# EAGLE design crown-B (EAGLE 6.4)
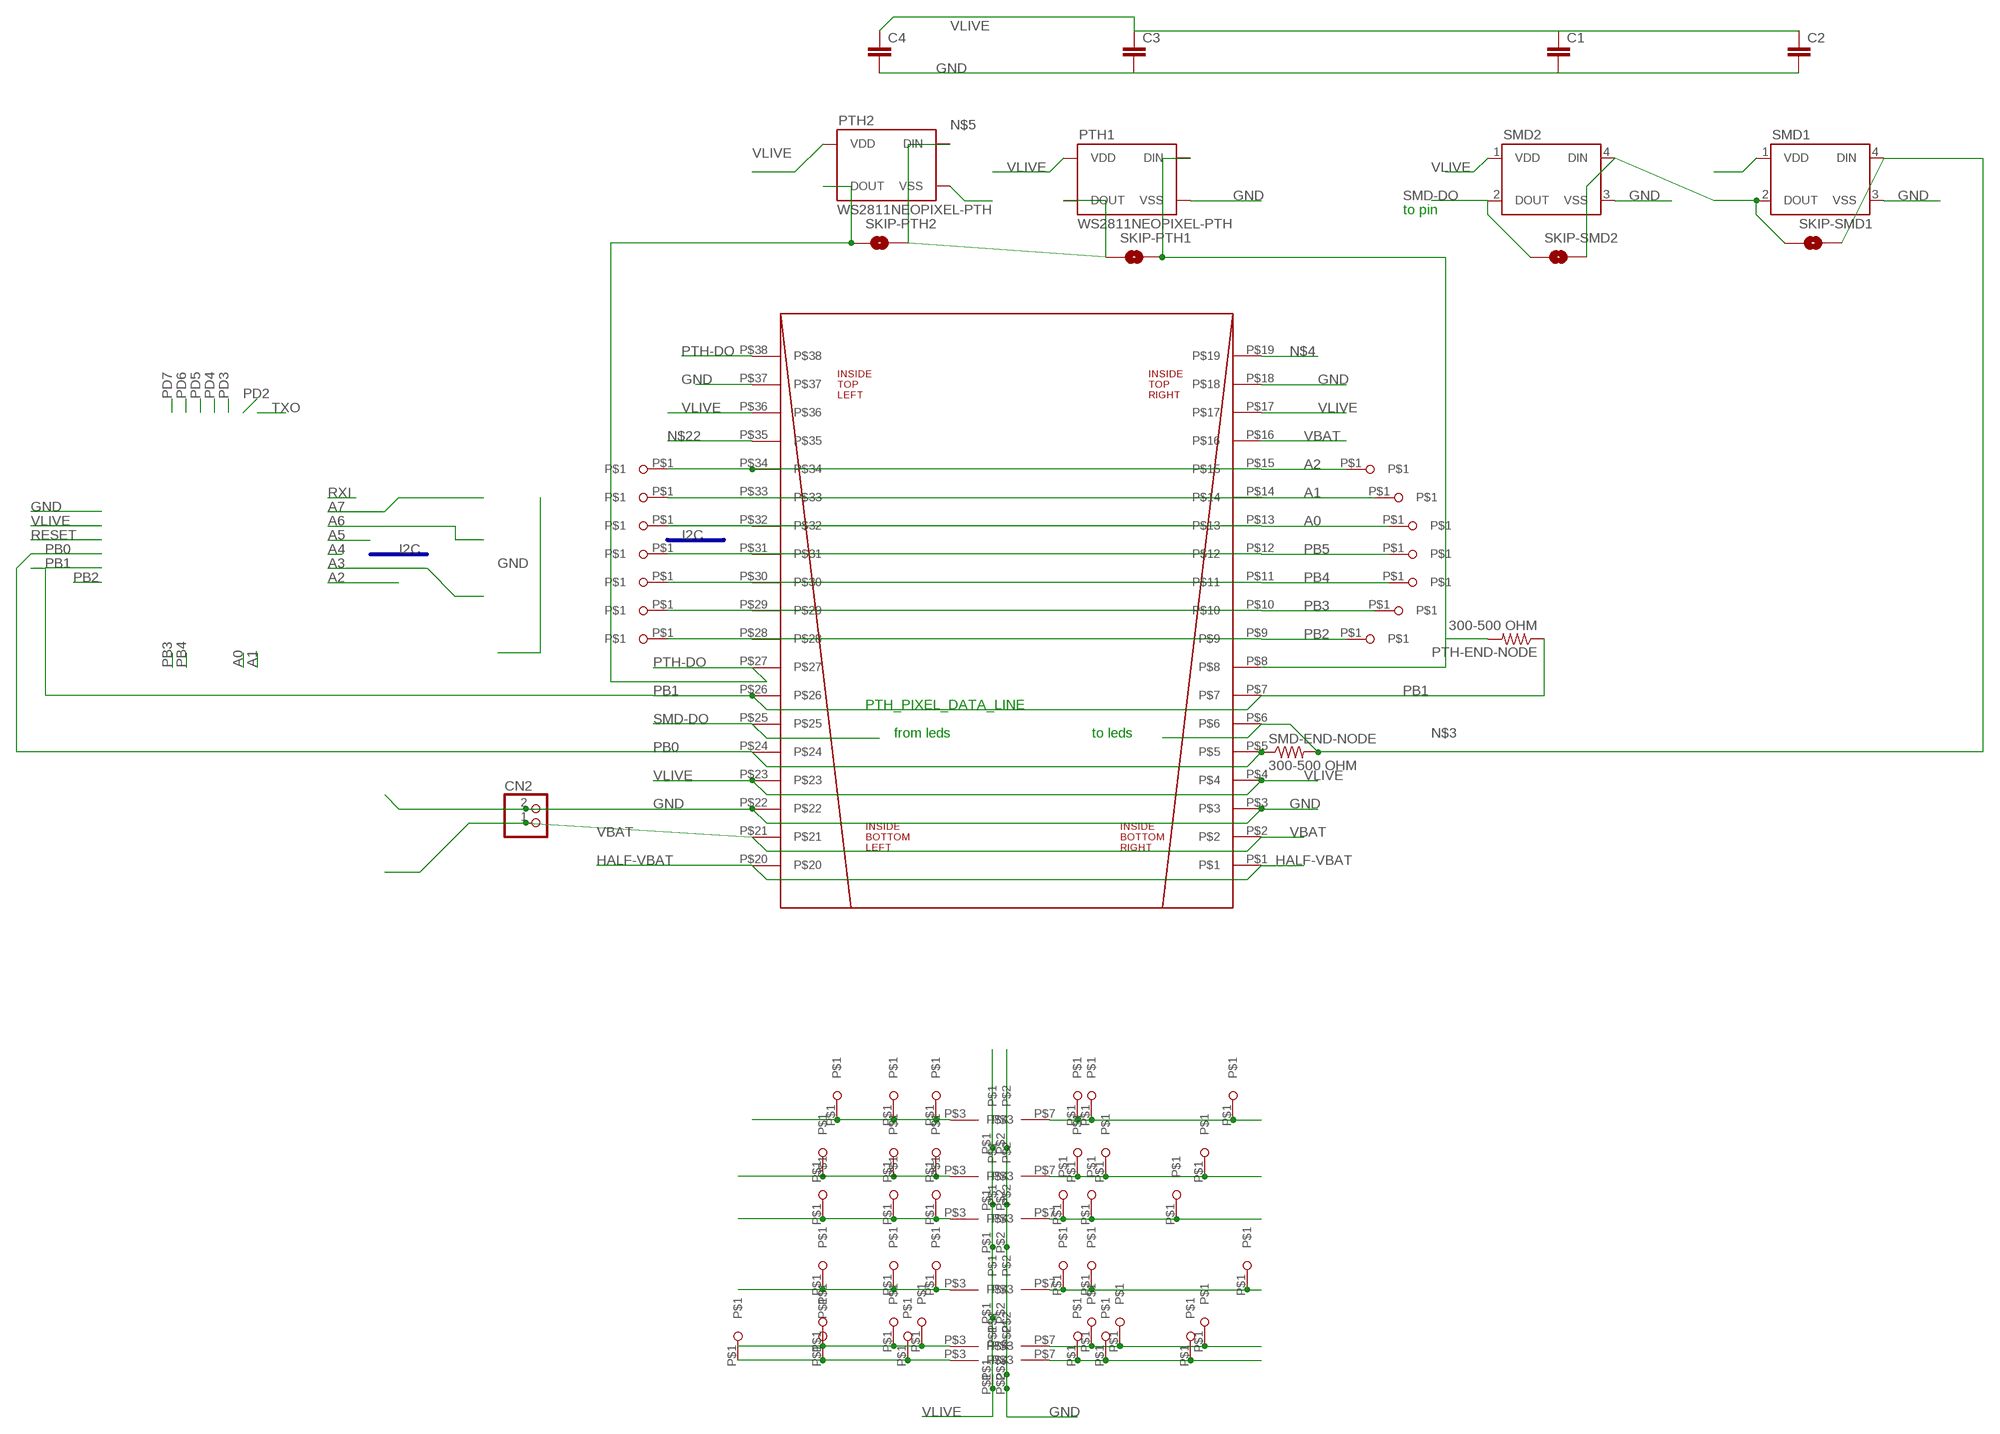
[diagram p0: schematic, sheet 1]

## Parts
C1  CAP0805  [0805]
C2  CAP0805  [0805]
C3  CAP0805  [0805]
C4  CAP0805  [0805]
CN2  JST_2PIN-SMT-RA  [JST-PH-2-SMT-RA]
PTH1  WS2811NEOPIXEL-PTH  [WS2811-PTH-FLAT]
PTH2  WS2811NEOPIXEL-PTH  [WS2811-PTH-FLAT]
PTH-END-NODE  300-500 OHM  RESISTOR0805-RES  [0805]
SKIP-PTH1  SOLDERJUMPERNC2  [SJ_2S-NOTRACE]
SKIP-PTH2  SOLDERJUMPERNC2  [SJ_2S-NOTRACE]
SKIP-SMD1  SOLDERJUMPERNC2  [SJ_2S-NOTRACE]
SKIP-SMD2  SOLDERJUMPERNC2  [SJ_2S-NOTRACE]
SMD1  WS2812B  [WS2812B]
SMD2  WS2812B  [WS2812B]
SMD-END-NODE  300-500 OHM  RESISTOR0805-RES  [0805]
U$1  SMD_BREADBOARD  [SMD_BREADBOARD_4X]
U$2  CROWNSTANDARD  [CROWN]
U$3  SMD_BREADBOARD  [SMD_BREADBOARD_4X]
U$4  SMD_BREADBOARD  [SMD_BREADBOARD_4X]
U$5  SMD_BREADBOARD  [SMD_BREADBOARD_4X]
U$6  SMD_BREADBOARD  [SMD_BREADBOARD_4X]
U$7  SMD_BREADBOARD  [SMD_BREADBOARD_4X]
U$10  SMD_PAD  [SMD_BREADBOARD_PAD]
U$11  SMD_PAD  [SMD_BREADBOARD_PAD]
U$12  SMD_PAD  [SMD_BREADBOARD_PAD]
U$13  SMD_PAD  [SMD_BREADBOARD_PAD]
U$14  SMD_PAD  [SMD_BREADBOARD_PAD]
U$15  SMD_PAD  [SMD_BREADBOARD_PAD]
U$16  SMD_PAD  [SMD_BREADBOARD_PAD]
U$17  SMD_PAD  [SMD_BREADBOARD_PAD]
U$22  SMD_PAD  [SMD_BREADBOARD_PAD]
U$23  SMD_PAD  [SMD_BREADBOARD_PAD]
U$24  SMD_PAD  [SMD_BREADBOARD_PAD]
U$25  SMD_PAD  [SMD_BREADBOARD_PAD]
U$26  SMD_PAD  [SMD_BREADBOARD_PAD]
U$27  SMD_PAD  [SMD_BREADBOARD_PAD]
U$28  SMD_PAD  [SMD_BREADBOARD_PAD]
U$29  SMD_PAD  [SMD_BREADBOARD_PAD]
U$34  SMD_PAD  [SMD_BREADBOARD_PAD]
U$35  SMD_PAD  [SMD_BREADBOARD_PAD]
U$36  SMD_PAD  [SMD_BREADBOARD_PAD]
U$37  SMD_PAD  [SMD_BREADBOARD_PAD]
U$38  SMD_PAD  [SMD_BREADBOARD_PAD]
U$39  SMD_PAD  [SMD_BREADBOARD_PAD]
U$40  SMD_PAD  [SMD_BREADBOARD_PAD]
U$41  SMD_PAD  [SMD_BREADBOARD_PAD]
U$42  SMD_PAD  [SMD_BREADBOARD_PAD]
U$43  SMD_PAD  [SMD_BREADBOARD_PAD]
U$44  SMD_PAD  [SMD_BREADBOARD_PAD]
U$45  SMD_PAD  [SMD_BREADBOARD_PAD]
U$46  SMD_PAD  [SMD_BREADBOARD_PAD]
U$47  SMD_PAD  [SMD_BREADBOARD_PAD]
U$48  SMD_PAD  [SMD_BREADBOARD_PAD]
U$49  SMD_PAD  [SMD_BREADBOARD_PAD]
U$50  SMD_PAD  [SMD_BREADBOARD_PAD]
U$51  SMD_PAD  [SMD_BREADBOARD_PAD]
U$52  SMD_PAD  [SMD_BREADBOARD_PAD]
U$53  SMD_PAD  [SMD_BREADBOARD_PAD]
U$54  SMD_PAD  [SMD_BREADBOARD_PAD]
U$55  SMD_PAD  [SMD_BREADBOARD_PAD]
U$56  SMD_PAD  [SMD_BREADBOARD_PAD]
U$57  SMD_PAD  [SMD_BREADBOARD_PAD]
U$58  SMD_PAD  [SMD_BREADBOARD_PAD]
U$59  SMD_PAD  [SMD_BREADBOARD_PAD]
U$62  SMD_PAD  [SMD_BREADBOARD_PAD]
U$63  SMD_PAD  [SMD_BREADBOARD_PAD]
U$64  SMD_PAD  [SMD_BREADBOARD_PAD]
U$65  SMD_PAD  [SMD_BREADBOARD_PAD]
U$68  SMD_PAD  [SMD_BREADBOARD_PAD]
U$69  SMD_PAD  [SMD_BREADBOARD_PAD]
U$70  SMD_PAD  [SMD_BREADBOARD_PAD]
U$71  SMD_PAD  [SMD_BREADBOARD_PAD]

## Nets
A0: U$2.P$13 U$2.P$32 U$44.P$1 U$55.P$1
A1: U$2.P$14 U$2.P$33 U$43.P$1 U$56.P$1
A2: U$2.P$15 U$2.P$34 U$42.P$1 U$58.P$1
GND: C1.2 C2.2 C3.2 C4.2 CN2.2 PTH1.P$2(VSS) PTH1.P$6(VSS) PTH2.P$2(VSS) PTH2.P$6(VSS) SMD1.3(VSS) SMD2.3(VSS) U$1.P$2 U$2.P$3 U$2.P$18 U$2.P$22 U$2.P$37 U$3.P$2 U$4.P$2 U$5.P$2 U$6.P$2 U$7.P$2
HALF-VBAT: U$2.P$1 U$2.P$20
N$2: U$1.P$3 U$24.P$1 U$25.P$1 U$63.P$1
N$3: SKIP-SMD1.2 SMD1.4(DIN) SMD-END-NODE.2 U$2.P$6
N$4: PTH1.P$4(DIN) PTH1.P$8(DIN) PTH-END-NODE.2 SKIP-PTH1.2 U$2.P$8 U$2.P$19
N$5: PTH1.P$1(DOUT) PTH1.P$5(DOUT) PTH2.P$4(DIN) PTH2.P$8(DIN) SKIP-PTH1.1 SKIP-PTH2.2
N$6: U$3.P$3 U$22.P$1 U$23.P$1 U$62.P$1
N$9: U$4.P$3 U$16.P$1 U$17.P$1 U$59.P$1
N$10: SKIP-SMD1.1 SKIP-SMD2.2 SMD1.2(DOUT) SMD2.4(DIN)
N$11: U$5.P$3 U$14.P$1 U$15.P$1 U$57.P$1
N$12: U$6.P$3 U$12.P$1 U$13.P$1 U$50.P$1
N$13: U$7.P$3 U$10.P$1 U$11.P$1 U$49.P$1
N$14: U$7.P$7 U$40.P$1 U$41.P$1 U$71.P$1
N$15: U$6.P$7 U$38.P$1 U$39.P$1 U$70.P$1
N$16: U$5.P$7 U$36.P$1 U$37.P$1 U$69.P$1
N$17: U$4.P$7 U$34.P$1 U$35.P$1 U$68.P$1
N$20: U$3.P$7 U$28.P$1 U$29.P$1 U$65.P$1
N$21: U$1.P$7 U$26.P$1 U$27.P$1 U$64.P$1
N$22: U$2.P$35
PB0: SMD-END-NODE.1 U$2.P$5 U$2.P$24
PB1: PTH-END-NODE.1 U$2.P$7 U$2.P$26
PB2: U$2.P$9 U$2.P$28 U$48.P$1 U$51.P$1
PB3: U$2.P$10 U$2.P$29 U$47.P$1 U$52.P$1
PB4: U$2.P$11 U$2.P$30 U$46.P$1 U$53.P$1
PB5: U$2.P$12 U$2.P$31 U$45.P$1 U$54.P$1
PTH-DO: PTH2.P$1(DOUT) PTH2.P$5(DOUT) SKIP-PTH2.1 U$2.P$27 U$2.P$38
SMD-DO: SKIP-SMD2.1 SMD2.2(DOUT) U$2.P$25
VBAT: CN2.1 U$2.P$2 U$2.P$16 U$2.P$21
VLIVE: C1.1 C2.1 C3.1 C4.1 PTH1.P$3(VDD) PTH1.P$7(VDD) PTH2.P$3(VDD) PTH2.P$7(VDD) SMD1.1(VDD) SMD2.1(VDD) U$1.P$1 U$2.P$4 U$2.P$17 U$2.P$23 U$2.P$36 U$3.P$1 U$4.P$1 U$5.P$1 U$6.P$1 U$7.P$1

## Buses
I2C

## Notes on the sheet
- to pin
- PTH_PIXEL_DATA_LINE
- from leds | to leds

## Library data of the parts
C1-C4 = SparkFun-Passives:CAP: Capacitor Standard 0603 ceramic capacitor, and 0.1" leaded capacitor.
CN2 = adafruit:JST_2PIN: JST 2-Pin Connectors of various flavors SMT-RA (S2B-PH-SM4) 4UConnector #17311 SMT (B2B-PH-SM4) THM-RA (S2B-PH) THM (B2B-PH)
PTH1 PTH2 = tekdemo:WS2811
PTH-END-NODE SMD-END-NODE = SparkFun-Passives:RESISTOR: Resistor Basic schematic elements and footprints for 0603, 1206, and PTH resistors.
SKIP-PTH1 SKIP-PTH2 SKIP-SMD1 SKIP-SMD2 = SparkFun-Passives:SOLDERJUMPER: Solder Jumper Standard SMD solder jumper. Used to automate production. Two varients : Normally Open and Normally Closed are the same, but have different paste layers. NC will have a large amount of paste and should jumper during reflow.
SMD1 SMD2 = SparkFun-LED:WS2812B: WS2812B - Intelligent control LED integrated light source Technical Specifications: Power Supply Voltage (VDD): 3.5 to 5.3 V Input Voltage (VI): -0.5 to VDD+0.5 V Operating Junction Temperature (Topt): -25°C to +80°C Storage Temperature Range (Tstg): -55°C to +150°C
U$1 U$3-U$7 = pcb_crown:SMD_BREADBOARD
U$2 = pcb_crown:CROWN
U$10-U$17 U$22-U$29 U$34-U$59 U$62-U$65 U$68-U$71 = pcb_crown:SMD_PAD

## Board
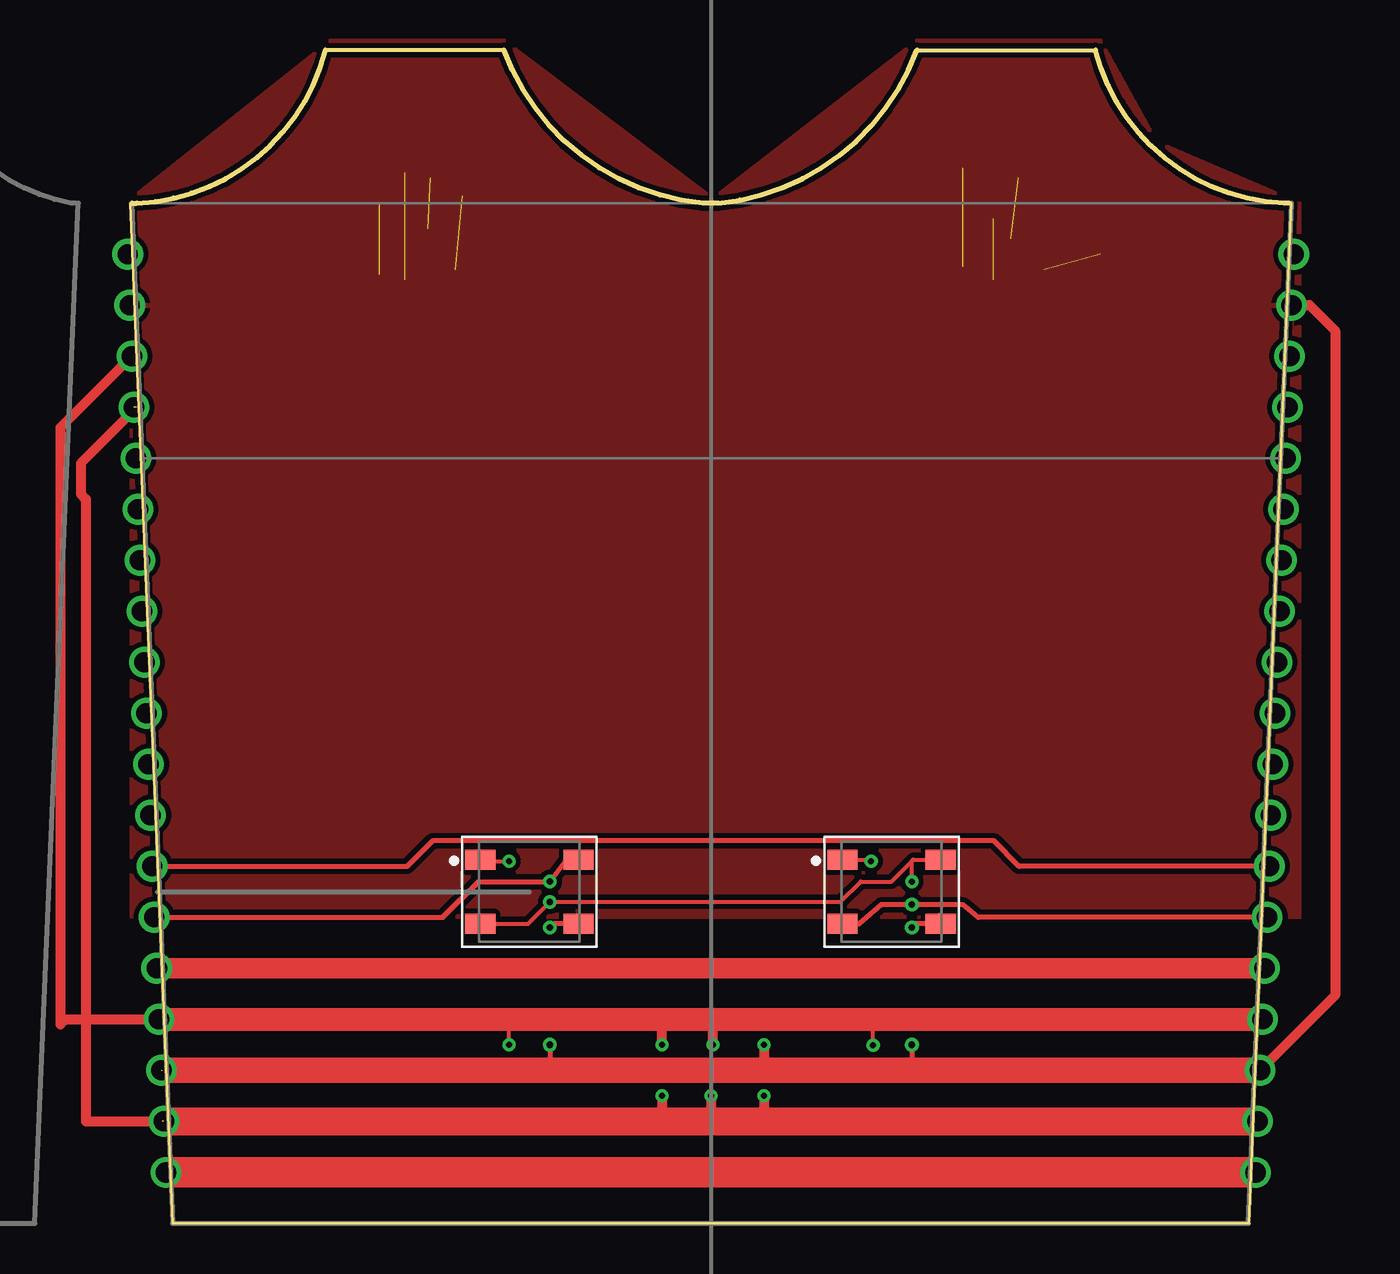
[diagram p1: board, top side]
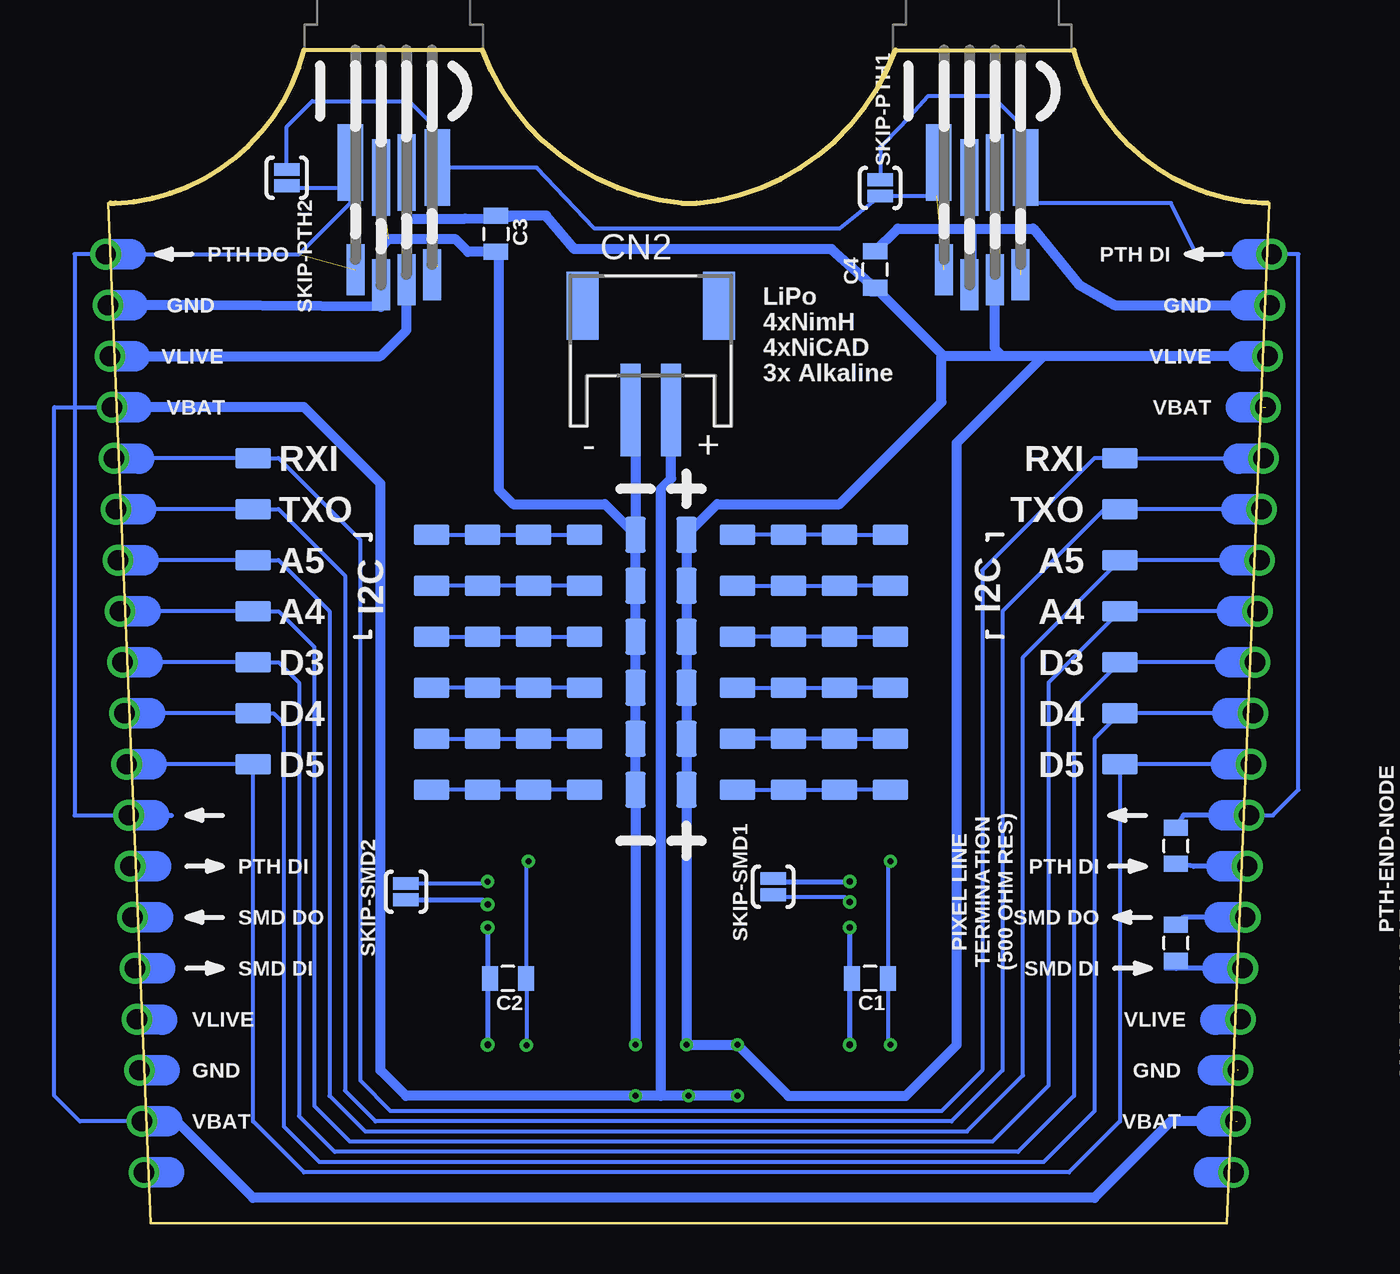
[diagram p2: board, bottom side, seen from below]

Size 57.84 x 58.42 mm. Coordinates in mm from the lower left corner, seen from the top.
Outline: 0.08,50.8 0.33,50.8 arc73 9.73,58.42 18.62,58.42 arc64 28.52,50.8 29.29,50.8 arc64 39.19,58.42 48.08,58.42 arc73 57.48,50.8 57.73,50.8
Copper layers (1*16): Top 0.0356mm / dielectric 1.5011mm / Bottom 0.0356mm
Design rules "LaenPCBOrder *": minimum track width 6mil, minimum drill 13mil, track to track 6mil, track to pad 6mil, pad to pad 6mil, via to via 6mil, smd to smd 6mil, copper to edge 5mil, drill to drill 6mil, minimum pad ring 7mil, minimum via ring 7mil, stop-mask expansion 4mil, vias tented up to drill 25mil, thermal gap 10mil

### Footprints (pad centres in the part's own frame; a part is rotated, then mirrored left to right if it is on the bottom)
0805 = smd 0.8 x 1.2: 1 -0.9,0; 2 0.9,0
JST-PH-2-SMT-RA = smd 1 x 4.6: 1 1,-3.7; 2 -1,-3.7 | smd 1.6 x 3.4: NC1 -3.4,1.5; NC2 3.4,1.5
WS2811-PTH-FLAT = smd 1.27 x 3.81: P$1 -2.159,-5.588; P$4 2.159,-5.842 | smd 0.889 x 3.81: P$2 -0.635,-6.35; P$3 0.635,-6.096 | smd 0.889 x 2.54: P$5 -1.905,-10.922; P$6 -0.635,-11.684; P$7 0.635,-11.43; P$8 1.905,-11.176
SJ_2S-NOTRACE = smd 0.635 x 1.27: 1 -0.401,0; 2 0.413,0
WS2812B = smd 1.5 x 1: 1 -2.45,1.6; 2 -2.45,-1.6; 3 2.45,-1.6; 4 2.45,1.6
SMD_BREADBOARD_4X = smd 1.016 x 1.778: P$1 -1.27,0; P$2 1.27,0 | smd 1.778 x 1.016: P$3 -3.81,0; P$7 3.81,0
CROWN = drill 1.016: P$1 -0.33,2.54; P$2 -0.432,5.08; P$3 -0.559,7.62; P$4 -0.686,10.16; P$5 -0.787,12.7; P$6 -0.914,15.24; P$7 -1.016,17.78; P$8 -1.092,20.32; P$9 -1.194,22.86; P$10 -1.295,25.4; P$11 -1.397,27.94; P$12 -1.524,30.48; P$13 -1.626,33.02; P$14 -1.727,35.56; P$15 -1.829,38.1; P$16 -1.93,40.64; P$17 -2.032,43.18; P$18 -2.134,45.72; P$19 -2.235,48.26; P$20 53.95,2.54; P$21 54.051,5.08; P$22 54.178,7.62; P$23 54.305,10.16; P$24 54.407,12.7; P$25 54.534,15.24; P$26 54.635,17.78; P$27 54.712,20.32; P$28 54.813,22.86; P$29 54.915,25.4; P$30 55.016,27.94; P$31 55.143,30.48; P$32 55.245,33.02; P$33 55.347,35.56; P$34 55.448,38.1; P$35 55.55,40.64; P$36 55.651,43.18; P$37 55.753,45.72; P$38 55.855,48.26
SMD_BREADBOARD_PAD = smd 1.778 x 1.016: P$1 0,0

### Placement (x,y rotation side)
C1  19.89,12.19 180 bottom
C2  37.92,12.19 180 bottom
C3  38.53,49.28 270 bottom
C4  19.63,47.5 90 bottom
CN2  30.81,44.2 0 bottom
PTH1  14.3,58.42 0 bottom
PTH2  43.61,58.42 0 bottom
PTH-END-NODE  4.65,18.8 90 bottom
SKIP-PTH1  19.38,51.56 90 bottom
SKIP-PTH2  48.95,52.07 90 bottom
SKIP-SMD1  24.71,16.76 90 bottom
SKIP-SMD2  43,16.51 90 bottom
SMD1  19.89,16.51 0 top
SMD2  37.92,16.51 0 top
SMD-END-NODE  4.65,13.97 90 bottom
U$1  30.3,34.29 180 bottom
U$2  2.11,0 0 top
U$3  30.3,31.75 180 bottom
U$4  30.3,29.21 180 bottom
U$5  30.3,26.67 180 bottom
U$6  30.3,24.13 180 bottom
U$7  30.3,21.59 180 bottom
U$10  23.95,21.59 0 bottom
U$11  21.41,21.59 0 bottom
U$12  23.95,24.13 0 bottom
U$13  21.41,24.13 0 bottom
U$14  23.95,26.67 0 bottom
U$15  21.41,26.67 0 bottom
U$16  23.95,29.21 0 bottom
U$17  21.41,29.21 0 bottom
U$22  23.95,31.75 0 bottom
U$23  21.41,31.75 0 bottom
U$24  23.95,34.29 180 bottom
U$25  21.41,34.29 180 bottom
U$26  36.65,34.29 0 bottom
U$27  39.19,34.29 0 bottom
U$28  36.65,31.75 0 bottom
U$29  39.19,31.75 0 bottom
U$34  36.65,29.21 0 bottom
U$35  39.19,29.21 0 bottom
U$36  36.65,26.67 0 bottom
U$37  39.19,26.67 0 bottom
U$38  36.65,24.13 0 bottom
U$39  39.19,24.13 0 bottom
U$40  36.65,21.59 0 bottom
U$41  39.19,21.59 0 bottom
U$42  50.62,38.1 0 bottom
U$43  50.62,35.56 0 bottom
U$44  50.62,33.02 0 bottom
U$45  50.62,30.48 0 bottom
U$46  50.62,27.94 0 bottom
U$47  50.62,25.4 0 bottom
U$48  50.62,22.86 0 bottom
U$49  18.87,21.59 180 bottom
U$50  18.87,24.13 180 bottom
U$51  7.44,22.86 180 bottom
U$52  7.44,25.4 180 bottom
U$53  7.44,27.94 180 bottom
U$54  7.44,30.48 180 bottom
U$55  7.44,33.02 180 bottom
U$56  7.44,35.56 180 bottom
U$57  18.87,26.67 180 bottom
U$58  7.44,38.1 180 bottom
U$59  18.87,29.21 180 bottom
U$62  18.87,31.75 0 bottom
U$63  18.87,34.29 0 bottom
U$64  41.73,34.29 0 bottom
U$65  41.73,31.75 0 bottom
U$68  41.73,29.21 0 bottom
U$69  41.73,26.67 0 bottom
U$70  41.73,24.13 0 bottom
U$71  41.73,21.59 0 bottom

### Tracks (layer width: path | path; a pad name or v marks a point on that pad's centre or on a via)
A0
  Bottom 0.203: 1.75,33.02 U$55.P$1 12.27,28.19 12.27,7.37 15.06,4.57 45.03,4.57 46.81,6.35 46.81,30.48 49.35,33.02 U$44.P$1 U$2.P$32
A1
  Bottom 0.203: U$2.P$14 U$56.P$1 8.2,35.56 13.28,30.48 13.28,7.62 15.82,5.08 44.53,5.08 46.05,6.6 46.05,32.26 49.35,35.56 U$43.P$1 U$2.P$33
A2
  Bottom 0.203: U$2.P$15 U$58.P$1 8.71,38.1 14.3,32.51 14.3,7.62 16.33,5.59 43.76,5.59 45.29,7.11 45.29,34.04 49.35,38.1 U$42.P$1 U$2.P$34
GND  (via drill 0.3, 0.33)  (3 unrouted)
  Top 0.254: SMD1.3 21.08,14.91 v20.9,14.73 | SMD2.3 39.12,14.91 v38.94,14.73 | v38.94,8.89 38.94,7.62 | v20.9,8.89 20.9,7.62
  Top 0.508: v31.57,8.89 31.57,7.62 | U$2.P$37 58.75,45.72 60.02,44.45 60.02,11.35 U$2.P$22
  Top 1.27: 1.6,7.62 20.9,7.62 31.57,7.62 38.94,7.62 U$2.P$22
  Bottom 0.203: 14.81,46.74 PTH1.P$6 | C4.2 19.89,48.4
  Bottom 0.254: v20.9,14.73 20.9,12.19 | 20.9,12.19 v20.9,8.89 | C1.2 20.9,12.19 | v38.94,14.73 38.94,12.19 | 38.94,12.19 v38.94,8.89 | C2.2 38.94,12.19
  Bottom 0.508: U$2.P$37 53.16,45.72 44.25,45.64 PTH2.P$6 44.25,48.64 43.87,49.02 40.56,49.02 39.92,48.38 C3.2 38.39,48.38 38.39,36.54 37.67,35.81 33.1,35.81 U$1.P$2 | C4.2 18.5,49.53 14.81,49.53 | 14.81,49.53 11.76,49.53 9.47,46.74 7.7,45.72 U$2.P$18 | PTH1.P$6 14.81,46.86 14.81,49.53 | v31.57,8.89 U$7.P$2 U$6.P$2 U$5.P$2 U$4.P$2 U$3.P$2 U$1.P$2 | 19.89,48.4 20,48.4 | CN2.2 31.57,40.5 U$1.P$2
  pour Top (isolate 0.254): 0.08,15.24 0.08,51.05 9.98,58.93 18.62,58.93 29.03,51.05 39.19,58.93 48.34,58.93 51.13,53.85 58.24,50.8 58.24,15.24
HALF-VBAT
  Top 1.524: U$2.P$1 U$2.P$20
N$2
  Bottom 0.203: U$63.P$1 U$25.P$1 U$24.P$1 U$1.P$3
N$3  (via drill 0.33)
  Top 0.254: U$2.P$6 15.57,15.24 17.35,17.02 v20.9,17.02 21.74,18.11 SMD1.4
  Bottom 0.254: U$2.P$6 4.28,15.24 SMD-END-NODE.2 | SKIP-SMD1.2 24.56,17.02 v20.9,17.02
N$4  (1 unrouted)
  Bottom 0.203: 12.4,50.8 12.4,52.32 12.27,52.45 | 12.27,52.45 PTH1.P$4 12.14,51.18 11.76,50.8 4.9,50.8 3.63,48.26 U$2.P$19 -1.45,48.26 -1.45,21.59 -0.18,20.32 2.36,20.32 | 12.27,52.45 12.27,54.61 13.79,56.13 17,56.13 18.36,54.61 19.38,53.59 SKIP-PTH1.2
  Bottom 0.254: 4.28,20.32 4.3,20.32 | PTH1.P$4 12.01,52.83 | PTH1.P$8 12.27,47.24 | U$2.P$8 2.36,20.32 4.28,20.32 | 4.28,20.32 PTH-END-NODE.2
N$5  (2 unrouted)
  Bottom 0.203: 41.45,47.62 41.58,47.5 | 16.59,53.09 16.21,52.7 16.21,54.48 | SKIP-PTH2.2 48.95,54.61 47.68,55.88 42.85,55.88 41.58,54.61 41.58,52.7 PTH2.P$4 36.5,52.58 33.6,49.53 21.41,49.53 SKIP-PTH1.1 16.57,51.16 PTH1.P$1
  Bottom 0.254: PTH2.P$8 41.58,47.5 | 16.59,53.09 PTH1.P$1
N$6
  Bottom 0.203: U$3.P$3 U$22.P$1 U$23.P$1 U$62.P$1
N$9
  Bottom 0.203: U$4.P$3 U$16.P$1 U$17.P$1 U$59.P$1
N$10  (via drill 0.3)
  Top 0.203: SMD1.2 19.81,14.91 v20.9,16 35.38,16 36.4,17.02 37.92,17.02 38.94,18.03 | 38.94,18.03 39.01,18.11 SMD2.4 | v38.94,17.02 38.94,18.03
  Bottom 0.203: SKIP-SMD1.1 24.61,16.26 21.16,16.26 v20.9,16 | SKIP-SMD2.2 39.03,16.92 v38.94,17.02
N$11
  Bottom 0.203: U$5.P$3 U$14.P$1 U$15.P$1 U$57.P$1
N$12
  Bottom 0.203: U$6.P$3 U$12.P$1 U$13.P$1 U$50.P$1
N$13
  Bottom 0.203: U$7.P$3 U$10.P$1 U$11.P$1 U$49.P$1
N$14
  Bottom 0.203: U$7.P$7 U$40.P$1 U$41.P$1 U$71.P$1
N$15
  Bottom 0.203: U$6.P$7 U$38.P$1 U$39.P$1 U$70.P$1
N$16
  Bottom 0.203: U$5.P$7 U$36.P$1 U$37.P$1 U$69.P$1
N$17
  Bottom 0.203: U$4.P$7 U$34.P$1 U$35.P$1 U$68.P$1
N$20
  Bottom 0.203: U$3.P$7 U$28.P$1 U$29.P$1 U$65.P$1
N$21
  Bottom 0.203: U$1.P$7 U$26.P$1 U$27.P$1 U$64.P$1
PB0
  Top 0.254: 17.44,12.79 17.35,12.7
  Top 1.016: U$2.P$5 17.35,12.7 U$2.P$24
  Bottom 0.152: 4.65,12.7 SMD-END-NODE.1
  Bottom 0.203: 5.16,12.7 4.65,12.7
  Bottom 0.254: U$2.P$5 4.65,12.7
PB1
  Top 0.254: U$2.P$26 44.27,17.78 43.03,19.05 15.06,19.05 13.79,17.78 U$2.P$7
  Bottom 0.203: 4.76,17.78 PTH-END-NODE.1
  Bottom 0.254: 3.77,17.78 3.78,17.78 | U$2.P$7 3.77,17.78 | 3.77,17.78 PTH-END-NODE.1
PB2
  Bottom 0.203: U$2.P$9 U$51.P$1 7.44,5.08 9.98,2.54 48.08,2.54 50.62,5.08 U$48.P$1 U$2.P$28
PB3
  Bottom 0.203: U$2.P$10 U$52.P$1 8.71,24.13 8.71,5.59 11.25,3.05 47.32,3.05 49.1,4.83 49.1,24.89 49.61,25.4 U$47.P$1 U$2.P$29
PB4
  Bottom 0.203: U$2.P$11 U$53.P$1 9.73,25.65 9.73,6.35 12.52,3.56 46.56,3.56 48.34,5.33 48.34,26.92 49.35,27.94 U$46.P$1 U$2.P$30
PB5
  Bottom 0.203: U$2.P$12 U$54.P$1 11,26.92 11,6.86 13.79,4.06 45.8,4.06 47.57,5.84 47.57,28.7 49.35,30.48 U$45.P$1 U$2.P$31 57.48,30.48
PTH-DO  (1 unrouted)
  Bottom 0.203: SKIP-PTH2.1 48.33,51.56 45.52,51.56 | U$2.P$27 59.51,20.32 59.51,48.26 56.72,48.26 48.34,48.26 45.77,50.83 PTH2.P$1
  Bottom 0.254: U$2.P$27 54.69,20.32 | 45.52,47.12 PTH2.P$5 | 45.52,51.56 45.52,51.92 PTH2.P$1
SMD-DO  (via drill 0.33)
  Top 0.254: U$2.P$25 42.24,15.24 41.48,15.88 v38.94,15.88 37.41,15.88 36.32,14.91 SMD2.2 35.64,14.91
  Bottom 0.254: SKIP-SMD2.1 39.17,16.11 v38.94,15.88
VBAT  (via drill 0.3)  (2 unrouted)
  Top 0.203: 28.93,5.23 28.78,5.08
  Top 0.508: 0.33,40.64 -2.46,37.85 -2.46,36.32 -2.21,36.07 -2.21,5.08 1.6,5.08 | v26.49,6.35 26.49,5.08 | v31.57,6.35 31.57,5.08 | v28.93,6.35 28.93,5.23
  Top 1.397: U$2.P$2 26.49,5.08 28.78,5.08 31.57,5.08 U$2.P$21
  Bottom 0.203: U$2.P$21 59.26,5.08 60.53,6.35 60.53,40.64 57.73,40.64
  Bottom 0.508: U$2.P$2 4.9,5.08 8.71,1.27 50.62,1.27 54.43,5.08 U$2.P$21 56.21,5.08 | v26.49,6.35 30.3,6.35 | 30.3,6.35 43,6.35 44.27,7.62 44.27,36.83 48.08,40.64 57.73,40.64 | 30.3,6.35 30.3,36.58 29.79,37.08 29.81,37.08 CN2.1
VLIVE  (via drill 0.3)  (2 unrouted)
  Top 0.203: v18.87,8.89 18.87,10.16 | SMD1.1 17.44,18.03 v18.87,18.03 | SMD2.1 36.65,18.11 v36.91,18.03 | v37.01,8.87 37.01,10.16
  Top 0.508: v29.03,8.89 29.03,10.16 | U$2.P$17 -3.48,39.62 -3.48,9.91 -3.23,10.16 1.35,10.16 | v26.49,8.89 26.49,10.16
  Top 1.143: U$2.P$4 18.87,10.16 26.49,10.16 29.03,10.16 37.01,10.16 U$2.P$23
  Bottom 0.203: v18.87,8.89 18.99,8.89 C1.1 18.99,17.92 arc90 v18.87,18.03 | v36.91,18.03 37.02,18.03 C2.1 | C2.1 37.16,12.19 | C2.1 37.01,12.19 v37.01,8.87
  Bottom 0.508: U$2.P$17 11.25,43.18 | 11.25,43.18 13.28,43.18 | 13.28,43.18 16.22,43.18 19.45,46.41 | 19.45,46.41 C4.1 21.8,48.51 34.62,48.51 36.03,50.18 C3.1 37.11,50.18 38.27,50.06 40.06,50.04 42.98,50.04 PTH2.P$3 | 13.28,43.18 13.67,43.56 PTH1.P$7 | U$2.P$36 44.27,43.18 42.98,44.48 PTH2.P$7 | 19.82,46.41 19.45,46.41 | 11.25,43.18 15.57,38.86 15.57,8.89 18.11,6.35 23.95,6.35 v26.49,8.89 v29.03,8.89 U$7.P$1 U$6.P$1 U$5.P$1 U$4.P$1 U$3.P$1 U$1.P$1 27.51,35.81 21.41,35.81 16.33,40.89 16.33,43.18

### Text on the board
bPlace: PTH DI | PTH DO | GND | LiPo | GND | 4xNimH | VLIVE | 4xNiCAD | VLIVE | 3x Alkaline | VBAT | VBAT | RXI | RXI | TXO | TXO | A5 | I2C | A5 | A4 | I2C | A4 | D3 | D3 | D4 | D4 | D5 | D5 | PTH DI | PTH DI | PIXEL LINE / TERMINATION / (500 OHM RES) | SMD DO | SMD DO | SMD DI | SMD DI | VLIVE | VLIVE | GND | GND | VBAT | VBAT